# Altium schematic sheet ACmonitor.SchDoc
size A3
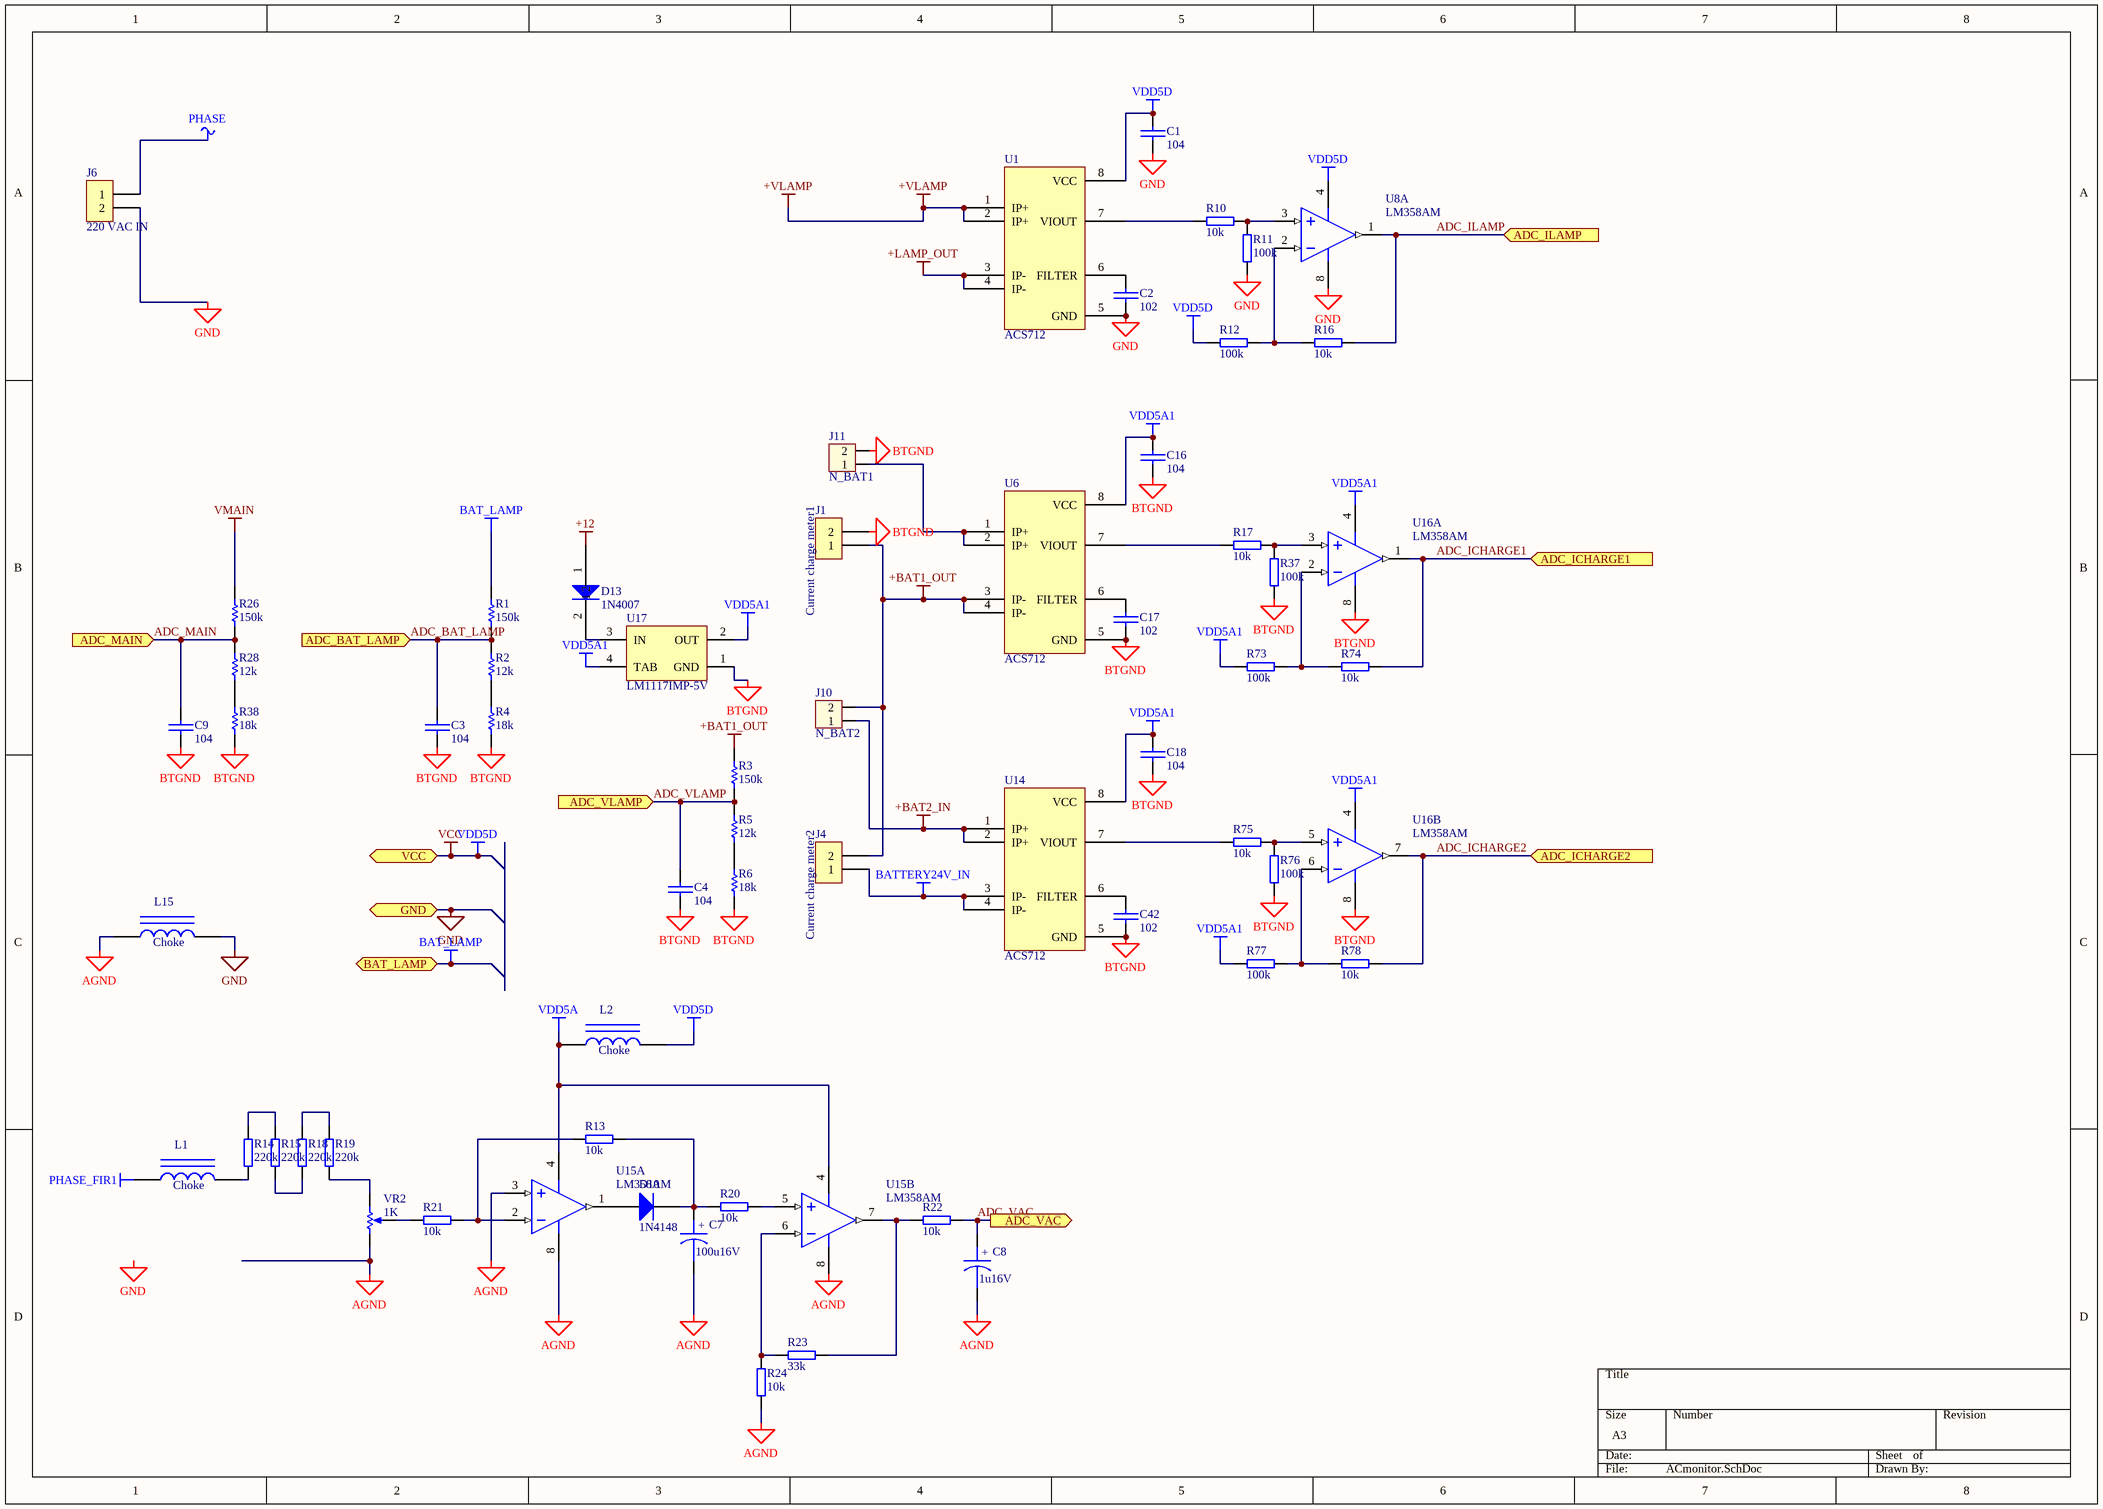
[diagram p0: ACmonitor.SchDoc]

## Parts
C1  104  [C6-0805_N]
C2  102  [C6-0805_N]
C3  104  [C6-0805_N]
C4  104  [C6-0805_N]
C7  100u16V  [CAPMP7343X310N]
C8  1u16V  [CAPMP3528X210N]
C9  104  [C6-0805_N]
C16  104  [C6-0805_N]
C17  102  [C6-0805_N]
C18  104  [C6-0805_N]
C42  102  [C6-0805_N]
D10  1N4148  [SOD80, LL-34]
D13  1N4007  [DO-214AA]
J1  Current charge meter1  [TERMINAL2]
J4  Current charge meter2  [TERMINAL2]
J6  220 VAC IN  [TERMINAL2]
J10  N_BAT2  [TERMINAL2]
J11  N_BAT1  [TERMINAL2]
L1  Choke  [R6-0805_N]
L2  Choke  [R6-0805_N]
L15  Choke  [R6-0805_N]
R1  150k  [6-0805_N]
R2  12k  [6-0805_N]
R3  150k  [6-0805_N]
R4  18k  [6-0805_N]
R5  12k  [6-0805_N]
R6  18k  [6-0805_N]
R10  10k  [6-0805_N]
R11  100k  [6-0805_N]
R12  100k  [6-0805_N]
R13  10k  [6-0805_N]
R14  220k  [R3216[1206]]
R15  220k  [R3216[1206]]
R16  10k  [6-0805_N]
R17  10k  [6-0805_N]
R18  220k  [R3216[1206]]
R19  220k  [R3216[1206]]
R20  10k  [6-0805_N]
R21  10k  [6-0805_N]
R22  10k  [6-0805_N]
R23  33k  [6-0805_N]
R24  10k  [6-0805_N]
R26  150k  [6-0805_N]
R28  12k  [6-0805_N]
R37  100k  [6-0805_N]
R38  18k  [6-0805_N]
R73  100k  [6-0805_N]
R74  10k  [6-0805_N]
R75  10k  [6-0805_N]
R76  100k  [6-0805_N]
R77  100k  [6-0805_N]
R78  10k  [6-0805_N]
U1  ACS712  [M08A_N]
U6  ACS712  [M08A_N]
U8  LM358AM  [M08A_N]  (part A of 2)
U14  ACS712  [M08A_N]
U15  LM358AM  [M08A_N]  (parts A,B of 2)
U16  LM358AM  [M08A_N]  (parts A,B of 2)
U17  LM1117IMP-5V  [MP04A_N]
VR2  1K  [BTXANH]

## Ports
ADC_BAT_LAMP, ADC_ICHARGE1, ADC_ICHARGE2, ADC_ILAMP, ADC_MAIN, ADC_VAC, ADC_VLAMP, BAT_LAMP, GND, VCC

## Nets
+12: D13.1
+BAT1_OUT: J1.1 J4.2 J10.2 R3.1 U6.3(IP-) U6.4(IP-)
+BAT2_IN: J10.1 U14.1(IP+) U14.2(IP+)
+LAMP_OUT: U1.3(IP-) U1.4(IP-)
+VLAMP: U1.1(IP+) U1.2(IP+)
AGND: C7.2 C8.2 L15.1 R24.2 U15.3(INA+) U15.8(V+) VR2.1(TOP)
BAT_LAMP: R1.1 ; port BAT_LAMP
BATTERY24V_IN: J4.1 U14.3(IP-) U14.4(IP-)
BTGND: C3.2 C4.2 C9.2 C16.2 C17.2 C18.2 C42.2 J1.2 J11.2 R4.2 R6.2 R37.2 R38.2 R76.2 U6.5(GND) U14.5(GND) U16.8(V+) U17.1(GND)
GND: C1.2 C2.2 J6.2 L15.2 R11.2 U1.5(GND) U8.8(V+) ; port GND
PHASE: J6.1
PHASE_FIR1: L1.1
VCC: C1.1 L2.2 R12.2 U1.8(VCC) U8.4(GND) ; port VCC  [also labelled VDD5D]
VDD5A: L2.1 U15.4(GND)
VDD5A1: C16.1 C18.1 R73.2 R77.2 U6.8(VCC) U14.8(VCC) U16.4(GND) U17.2(OUT) U17.4(TAB)
VMAIN: R26.1
ADC_BAT_LAMP: C3.1 R1.2 R2.1 ; port ADC_BAT_LAMP
ADC_ICHARGE1: R74.2 U16.1(OUTA) ; port ADC_ICHARGE1
ADC_ICHARGE2: R78.2 U16.7(OUTB) ; port ADC_ICHARGE2
ADC_ILAMP: R16.2 U8.1(OUTA) ; port ADC_ILAMP
ADC_MAIN: C9.1 R26.2 R28.1 ; port ADC_MAIN
ADC_VAC: C8.1 R22.1 ; port ADC_VAC
ADC_VLAMP: C4.1 R3.2 R5.1 ; port ADC_VLAMP
NetC2_1: C2.1 U1.6(FILTER)
NetC7_1: C7.1 D10.2(K) R13.1 R20.2
NetC17_1: C17.1 U6.6(FILTER)
NetC42_1: C42.1 U14.6(FILTER)
NetD10_1: D10.1(A) U15.1(OUTA)
NetD13_2: D13.2 U17.3(IN)
NetJ11_1: J11.1 U6.1(IP+) U6.2(IP+)
NetL1_2: L1.2 R14.2
NetR2_2: R2.2 R4.1
NetR5_2: R5.2 R6.1
NetR10_1: R10.1 R11.1 U8.3(INA+)
NetR10_2: R10.2 U1.7(VIOUT)
NetR12_1: R12.1 R16.1 U8.2(INA-)
NetR13_2: R13.2 R21.1 U15.2(INA-)
NetR14_1: R14.1 R15.1
NetR15_2: R15.2 R18.2
NetR17_1: R17.1 R37.1 U16.3(INA+)
NetR17_2: R17.2 U6.7(VIOUT)
NetR18_1: R18.1 R19.1
NetR19_2: R19.2 VR2.3(BOT)
NetR20_1: R20.1 U15.5(INB+)
NetR21_2: R21.2 VR2.2(TAP)
NetR22_2: R22.2 R23.1 U15.7(OUTB)
NetR23_2: R23.2 R24.1 U15.6(INB-)
NetR28_2: R28.2 R38.1
NetR73_1: R73.1 R74.1 U16.2(INA-)
NetR75_1: R75.1 R76.1 U16.5(INB+)
NetR75_2: R75.2 U14.7(VIOUT)
NetR77_1: R77.1 R78.1 U16.6(INB-)

## Notes on the sheet
- Labels drawn without touching a wire or pin: GND
- (in symbol CAPACITOR POL) +

## Library data of the parts
C1-C4 C9 C16-C18 C42 = CAP: Capacitor
C7 C8 = CAPACITOR POL: Capacitor
D10 = Diode 1N4007: 1 Amp General Purpose Rectifier; pin to pad: 1>A 2>K; Published: 8-Jun-2000; LatestRevisionDate: 17-Jul-2002; LatestRevisionNote: Re-released for DXP Platform.; DatasheetDocument: 1998; PackageDocument: Aug-1999; PackageReference: DO-41; Publisher: Altium Limited; Code_JEDEC: DO-204-AL; ComponentLink1Description: Manufacturer Link; ComponentLink1URL: http://www.fairchildsemi.com/; ComponentLink2Description: Datasheet; ComponentLink2URL: http://www.fairchildsemi.com/ds/1N%2F1N4001.pdf
D13 = DIODE: pin to pad: 1>A 2>K
J1 J4 J6 = CON2: Connector
J10 J11 = Con2: Connector 2; Value: Connector 2
L1 L2 L15 = INDUCTOR IRON
R1-R6 R26 R28 R38 = Res Semi: Semiconductor Resistor; Published: *; LatestRevisionDate: *; LatestRevisionNote: *; PackageReference: *; Publisher: *; Value: *
R10-R24 R37 R73-R78 = RES2
U8 U15 U16 = LM358AM: Low Power Dual Operational Amplifier, 8-pin Narrow SOIC; Manufacturer: National Semiconductor; PackageTopMarking: NSZXTT*LM*358AM; PowerWise: N; CompType: Amplifiers; Published: 4-Dec-2008; LatestRevisionDate: 13-Jan-2009; LatestRevisionNote: Sim Model Added.; DatasheetVersion: Oct-2005; PackageVersion: revM, May-2009; PackageReference: M08A; Publisher: Altium Limited; PackageDescription: SOIC Narrow, 4.9 x 3.9 x 1.45mm, 8 Lead, 1.27mm Pitch; Supplier 1: Farnell; Supplier Part Number 1: 9486801; PartNumber: LM358AM; RoHS: N; PinCount: 8; Code_JEDEC: MS-012-AA; Code_IPC: SOIC127P600-8; ComponentLink1Description: LM358 Datasheet; ComponentLink1URL: http://www.national.com/ds/LM/LM358.pdf; ComponentLink2Description: LM358 Web Page; ComponentLink2URL: http://www.national.com/pf/LM/LM358.html; ComponentLink3Description: M08A Package Page; ComponentLink3URL: http://www.national.com/packaging/folders/m08a.html
U17 = LM1117IMP-3.3: 800mA Low-Dropout Linear Regulator, 4-pin SOT-223; Manufacturer: National Semiconductor; PackageTopMarking: XYTT*N05B; PowerWise: N; CompType: LDO IC; Published: 4-Dec-2008; DatasheetVersion: Apr-2006; PackageVersion: revB, Apr-2003; PackageReference: MP04A; Publisher: Altium Limited; PackageDescription: Molded SOT-223, 6.50 x 3.56 x 1.6mm Body, 4 Lead, 2.3mm Pitch; Supplier 1: Farnell; Supplier Part Number 1: 7614123; PartNumber: LM1117IMP-3.3; RoHS: N; PinCount: 4; Code_JEDEC: TO-261-AA; Code_IPC: SOT223-4; ComponentLink1Description: LM1117 Datasheet; ComponentLink1URL: http://www.national.com/ds/LM/LM1117.pdf; ComponentLink2Description: LM1117 Web Page; ComponentLink2URL: http://www.national.com/pf/LM/LM1117.html; ComponentLink3Description: MP04A Package Page; ComponentLink3URL: http://www.national.com/packaging/folders/mp04a.html
VR2 = RPot: Potentiometer; Published: *; LatestRevisionDate: *; LatestRevisionNote: *; PackageReference: *; Publisher: *; Sim Note: *; Set Position: *; Value: *